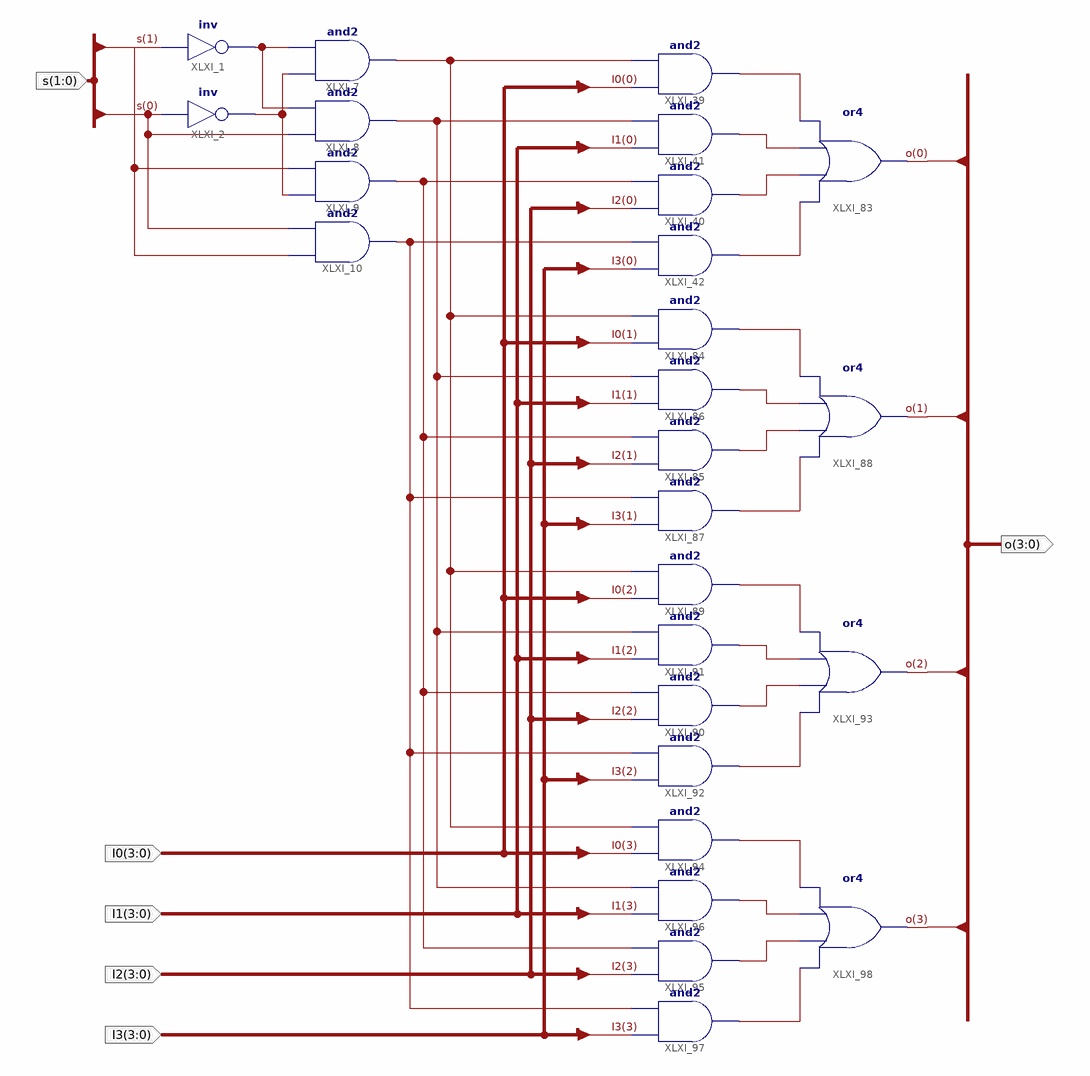
[diagram p0: schematic sheet 1]
// Xilinx ISE schematic Mux4to1b4.sch (kintex7) as structural Verilog: 26 symbols, 6 ports
module Mux4to1b4 (
  input  [1:0] s,
  input  [3:0] I3,
  input  [3:0] I0,
  input  [3:0] I2,
  input  [3:0] I1,
  output [3:0] o
);

  wire NS0, NS1, S0, S1, S2, S3, XLXN_55, XLXN_56, XLXN_57, XLXN_58, XLXN_59, XLXN_60, XLXN_61, XLXN_62,
       XLXN_63, XLXN_64, XLXN_65, XLXN_66, XLXN_67, XLXN_68, XLXN_69, XLXN_70;

  not XLXI_2 (NS0, s[0]);
  not XLXI_1 (NS1, s[1]);
  and XLXI_7 (S0, NS0, NS1);
  and XLXI_9 (S2, NS0, s[1]);
  and XLXI_8 (S1, s[0], NS1);
  and XLXI_10 (S3, s[1], s[0]);
  and XLXI_39 (XLXN_55, I0[0], S0);
  and XLXI_40 (XLXN_57, I2[0], S2);
  and XLXI_41 (XLXN_56, I1[0], S1);
  and XLXI_42 (XLXN_58, I3[0], S3);
  or XLXI_83 (o[0], XLXN_58, XLXN_57, XLXN_56, XLXN_55);
  and XLXI_84 (XLXN_59, I0[1], S0);
  and XLXI_85 (XLXN_61, I2[1], S2);
  and XLXI_86 (XLXN_60, I1[1], S1);
  and XLXI_87 (XLXN_62, I3[1], S3);
  or XLXI_88 (o[1], XLXN_62, XLXN_61, XLXN_60, XLXN_59);
  and XLXI_89 (XLXN_63, I0[2], S0);
  and XLXI_90 (XLXN_65, I2[2], S2);
  and XLXI_91 (XLXN_64, I1[2], S1);
  and XLXI_92 (XLXN_66, I3[2], S3);
  or XLXI_93 (o[2], XLXN_66, XLXN_65, XLXN_64, XLXN_63);
  and XLXI_94 (XLXN_67, I0[3], S0);
  and XLXI_95 (XLXN_69, I2[3], S2);
  and XLXI_96 (XLXN_68, I1[3], S1);
  and XLXI_97 (XLXN_70, I3[3], S3);
  or XLXI_98 (o[3], XLXN_70, XLXN_69, XLXN_68, XLXN_67);
endmodule
